# EAGLE design zik-pcb-gpu-f407 (EAGLE 6.5.0)
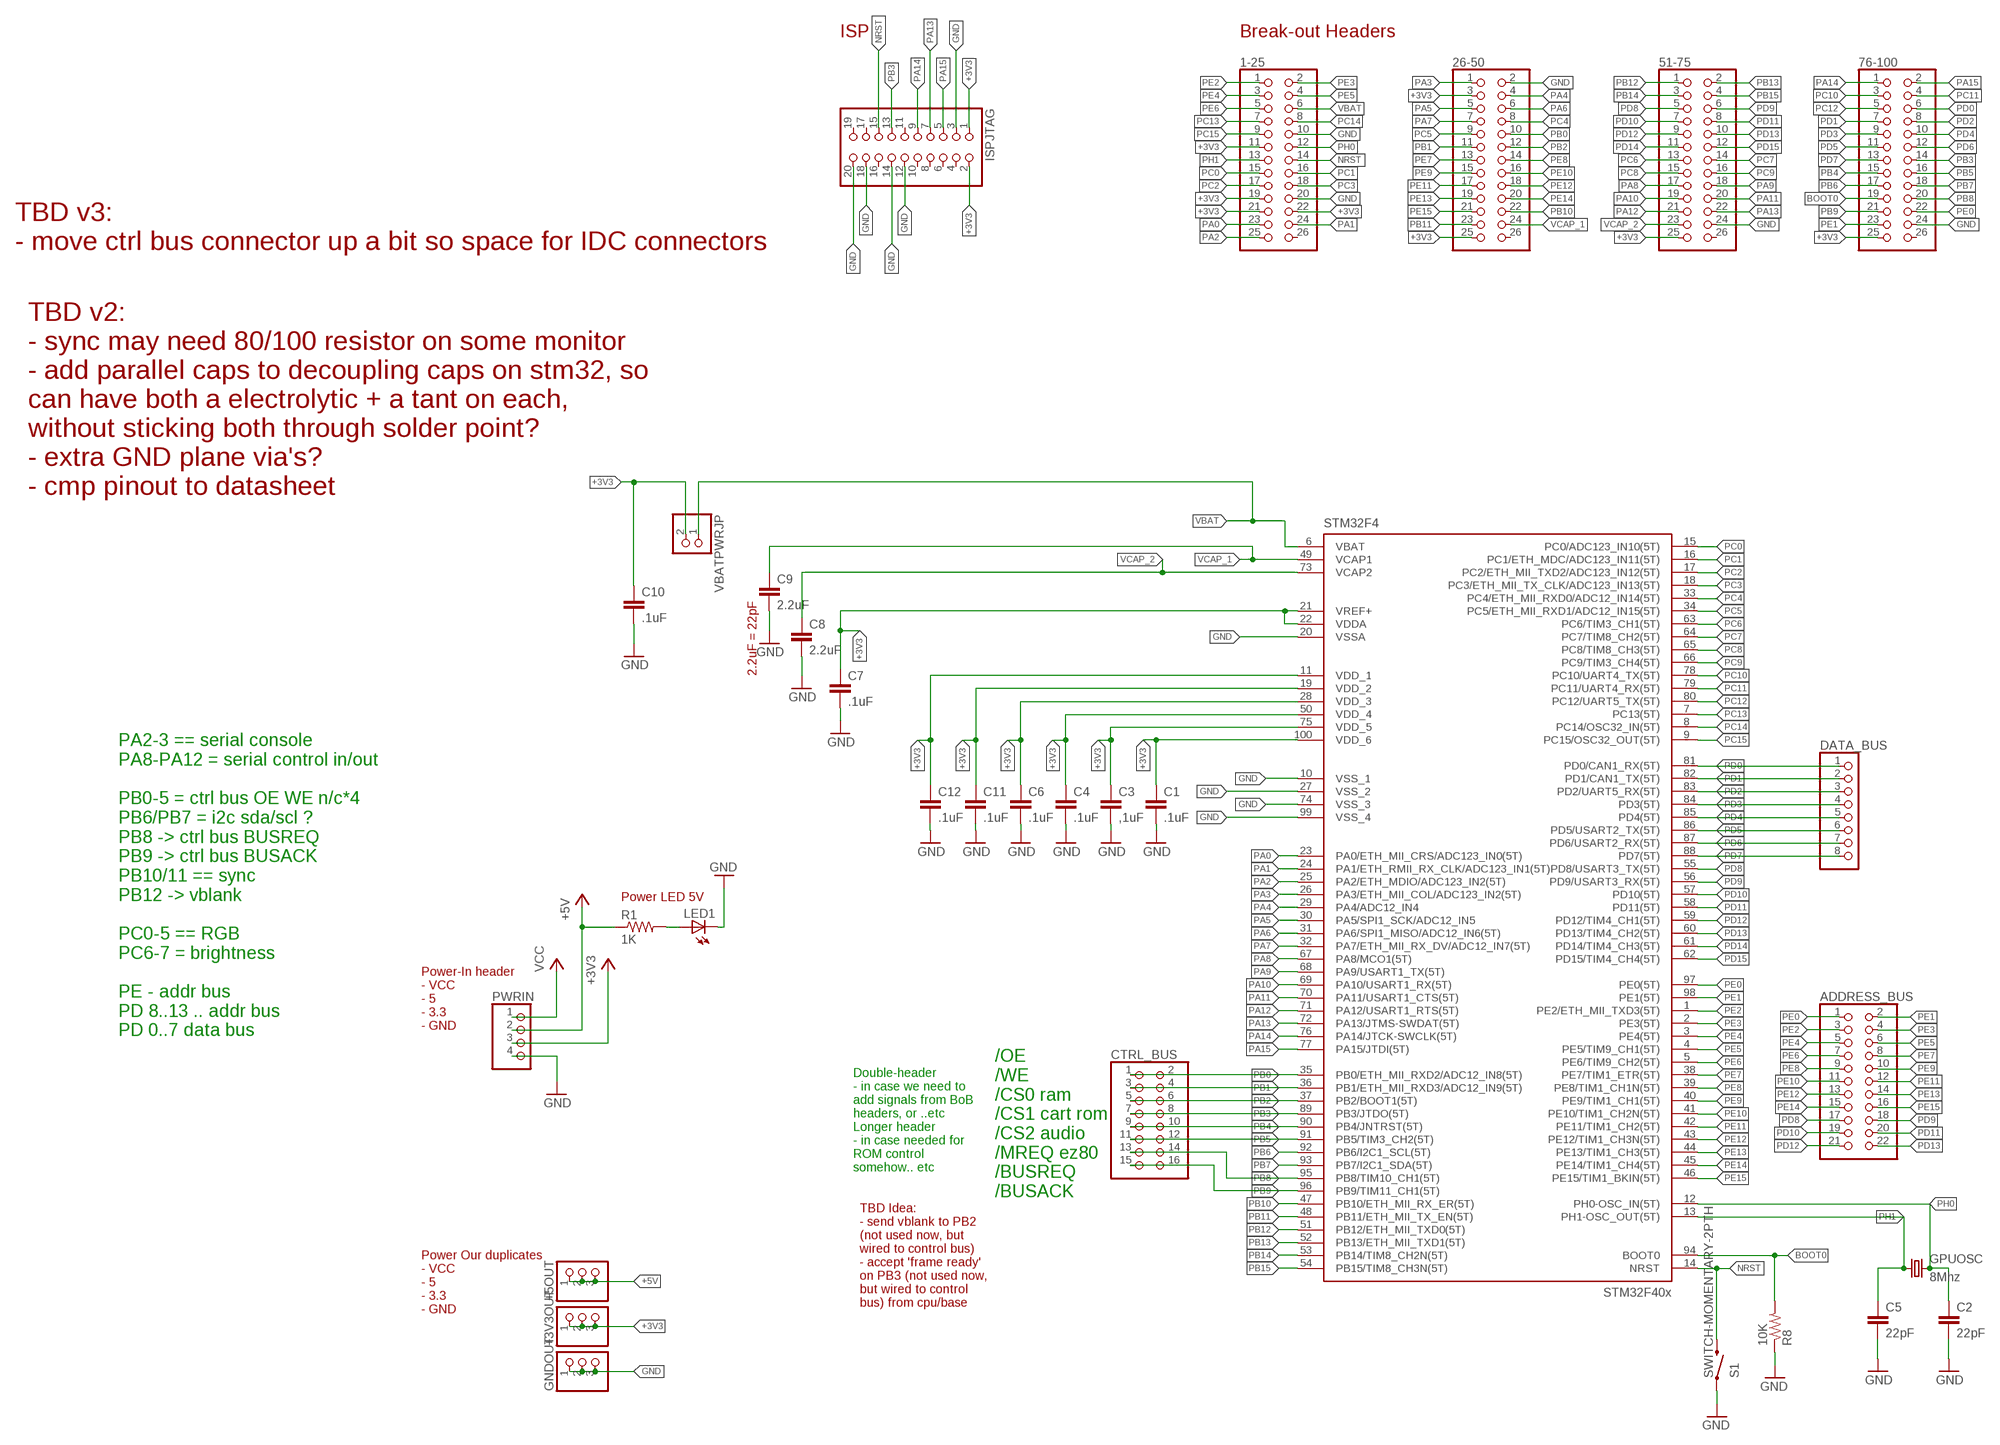
[diagram p0: schematic, sheet 1, part 1 of 2]
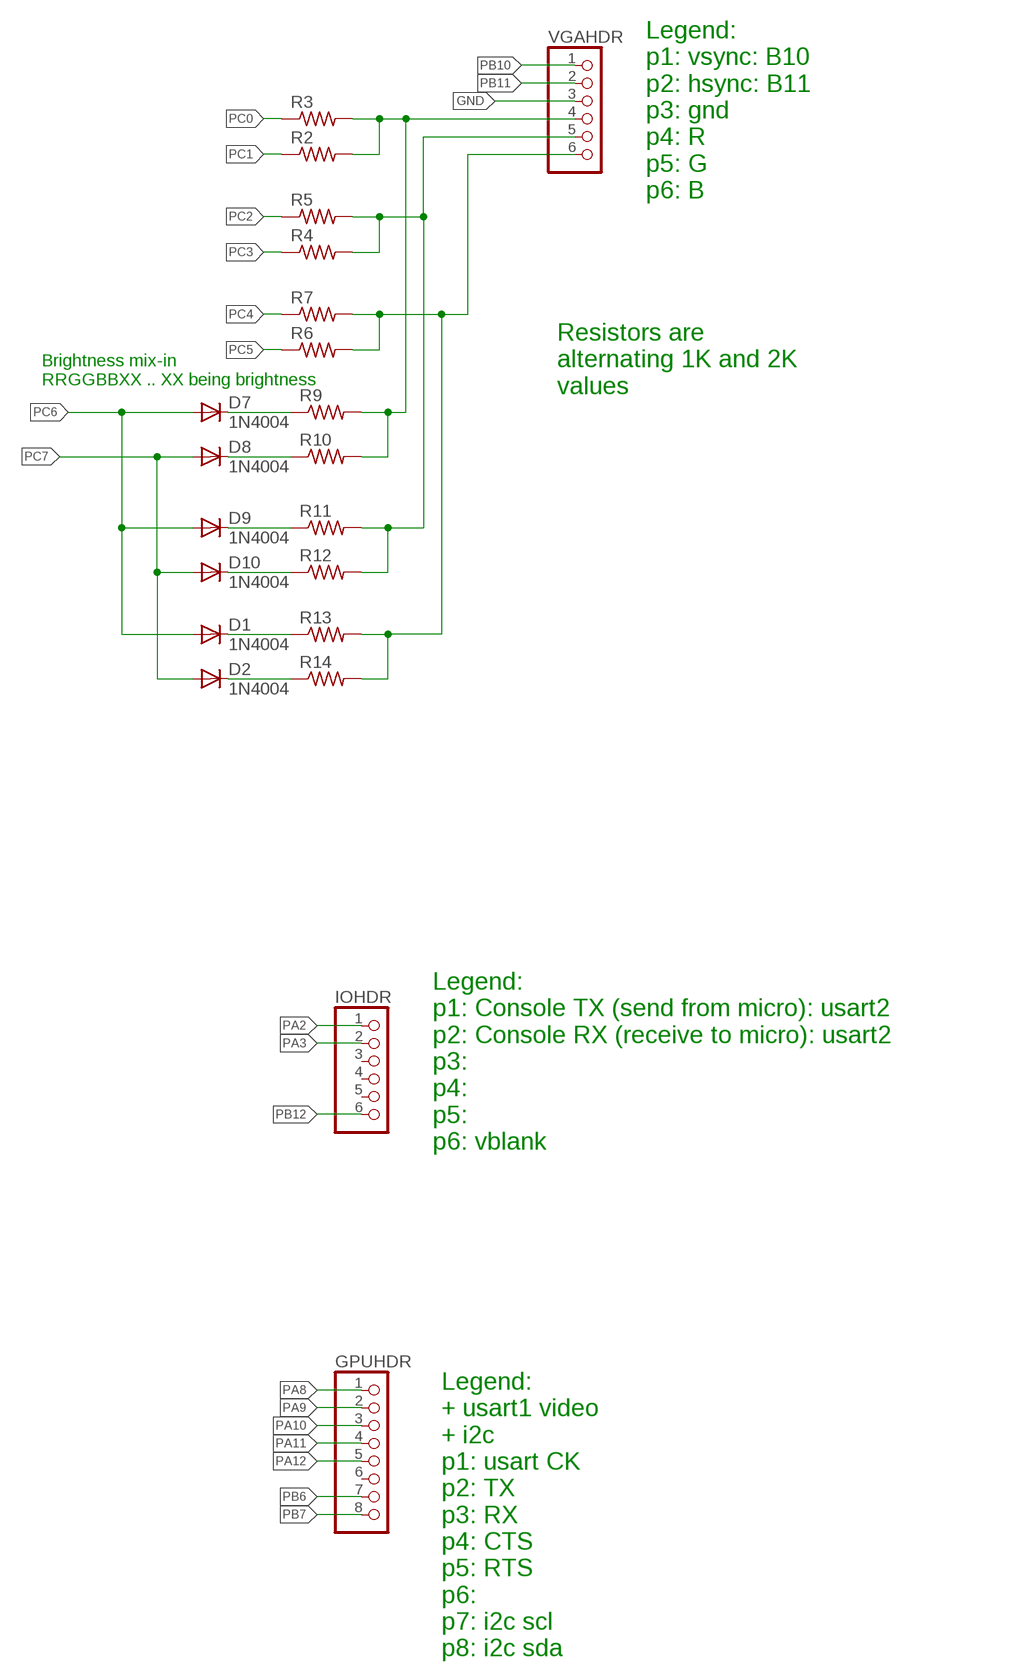
[diagram p1: schematic, sheet 1, part 2 of 2]

## Parts
1-25  PINHD-2X13  [2X13]
26-50  PINHD-2X13  [2X13]
51-75  PINHD-2X13  [2X13]
76-100  PINHD-2X13  [2X13]
+3V3OUT  PINHD-1X3  [1X03]
+5OUT  PINHD-1X3  [1X03]
ADDRESS_BUS  PINHD-2X11  [2X11]
C1  .1uF  C-EU025-025X050  [C025-025X050]
C2  22pF  C-EU025-025X050  [C025-025X050]
C3  ,1uF  C-EU025-025X050  [C025-025X050]
C4  .1uF  C-EU025-025X050  [C025-025X050]
C5  22pF  C-EU025-025X050  [C025-025X050]
C6  .1uF  C-EU025-025X050  [C025-025X050]
C7  .1uF  C-EU025-025X050  [C025-025X050]
C8  2.2uF  C-EU025-025X050  [C025-025X050]
C9  2.2uF  C-EU025-025X050  [C025-025X050]
C10  .1uF  C-EU025-025X050  [C025-025X050]
C11  .1uF  C-EU025-025X050  [C025-025X050]
C12  .1uF  C-EU025-025X050  [C025-025X050]
CTRL_BUS  PINHD-2X8  [2X08]
D1  1N4004  [DO41-10]
D2  1N4004  [DO41-10]
D7  1N4004  [DO41-10]
D8  1N4004  [DO41-10]
D9  1N4004  [DO41-10]
D10  1N4004  [DO41-10]
DATA_BUS  PINHD-1X8  [1X08]
GNDOUT  PINHD-1X3  [1X03]
GPUHDR  PINHD-1X8  [1X08]
GPUOSC  8Mhz  CRYSTALHC49US  [HC49US]
IOHDR  PINHD-1X6  [1X06]
ISPJTAG  PINHD-2X10  [2X10]
LED1  LED5MM  [LED5MM]
PWRIN  PINHD-1X4  [1X04]
R1  1K  R-US_0207/10  [0207/10]
R2  R-US_0207/10  [0207/10]
R3  R-US_0207/10  [0207/10]
R4  R-US_0207/10  [0207/10]
R5  R-US_0207/10  [0207/10]
R6  R-US_0207/10  [0207/10]
R7  R-US_0207/10  [0207/10]
R8  10K  R-US_0207/10  [0207/10]
R9  R-US_0207/10  [0207/10]
R10  R-US_0207/10  [0207/10]
R11  R-US_0207/10  [0207/10]
R12  R-US_0207/10  [0207/10]
R13  R-US_0207/10  [0207/10]
R14  R-US_0207/10  [0207/10]
S1  SWITCH-MOMENTARY-2PTH  [TACTILE-PTH]
STM32F4  STM32F407V  [TQFP100]
VBATPWRJP  PINHD-1X2  [1X02]
VGAHDR  PINHD-1X6  [1X06]

## Nets
+3V3: 1-25.11 1-25.19 1-25.21 1-25.22 26-50.3 26-50.25 51-75.25 76-100.25 +3V3OUT.1 +3V3OUT.2 +3V3OUT.3 C1.1 C3.1 C4.1 C6.1 C7.1 C10.1 C11.1 C12.1 ISPJTAG.1 ISPJTAG.2 PWRIN.3 STM32F4.11(VDD_1) STM32F4.19(VDD_2) STM32F4.21(VREF+) STM32F4.22(VDDA) STM32F4.28(VDD_3) STM32F4.50(VDD_4) STM32F4.75(VDD_5) STM32F4.100(VDD_6) VBATPWRJP.2
+5V: +5OUT.1 +5OUT.2 +5OUT.3 PWRIN.2 R1.1
BOOT0: 76-100.19 R8.2 STM32F4.94(BOOT0)
GND: 1-25.10 1-25.20 26-50.2 51-75.24 76-100.24 C1.2 C2.2 C3.2 C4.2 C5.2 C6.2 C7.2 C8.2 C9.2 C10.2 C11.2 C12.2 GNDOUT.1 GNDOUT.2 GNDOUT.3 ISPJTAG.3 ISPJTAG.12 ISPJTAG.14 ISPJTAG.18 ISPJTAG.20 LED1.K(C) PWRIN.4 R8.1 S1.1 STM32F4.10(VSS_1) STM32F4.20(VSSA) STM32F4.27(VSS_2) STM32F4.74(VSS_3) STM32F4.99(VSS_4) VGAHDR.3
N$3: LED1.A R1.2
N$4: D7.C R9.1
N$5: R4.2 R5.2 R11.2 R12.2 VGAHDR.5
N$7: D8.C R10.1
N$8: R6.2 R7.2 R13.2 R14.2 VGAHDR.6
N$9: R2.2 R3.2 R9.2 R10.2 VGAHDR.4
N$12: D9.C R11.1
N$14: D10.C R12.1
N$17: D1.C R13.1
N$19: D2.C R14.1
NRST: 1-25.14 ISPJTAG.15 S1.3 STM32F4.14(NRST)
PA0: 1-25.23 STM32F4.23(PA0/ETH_MII_CRS/ADC123_IN0(5T))
PA1: 1-25.24 STM32F4.24(PA1/ETH_RMII_RX_CLK/ADC123_IN1(5T))
PA2: 1-25.25 IOHDR.1 STM32F4.25(PA2/ETH_MDIO/ADC123_IN2(5T))
PA3: 26-50.1 IOHDR.2 STM32F4.26(PA3/ETH_MII_COL/ADC123_IN2(5T))
PA4: 26-50.4 STM32F4.29(PA4/ADC12_IN4)
PA5: 26-50.5 STM32F4.30(PA5/SPI1_SCK/ADC12_IN5)
PA6: 26-50.6 STM32F4.31(PA6/SPI1_MISO/ADC12_IN6(5T))
PA7: 26-50.7 STM32F4.32(PA7/ETH_MII_RX_DV/ADC12_IN7(5T))
PA8: 51-75.17 GPUHDR.1 STM32F4.67(PA8/MCO1(5T))
PA9: 51-75.18 GPUHDR.2 STM32F4.68(PA9/USART1_TX(5T))
PA10: 51-75.19 GPUHDR.3 STM32F4.69(PA10/USART1_RX(5T))
PA11: 51-75.20 GPUHDR.4 STM32F4.70(PA11/USART1_CTS(5T))
PA12: 51-75.21 GPUHDR.5 STM32F4.71(PA12/USART1_RTS(5T))
PA13: 51-75.22 ISPJTAG.7 STM32F4.72(PA13/JTMS-SWDAT(5T))
PA14: 76-100.1 ISPJTAG.9 STM32F4.76(PA14/JTCK-SWCLK(5T))
PA15: 76-100.2 ISPJTAG.5 STM32F4.77(PA15/JTDI(5T))
PB0: 26-50.10 CTRL_BUS.1 CTRL_BUS.2 STM32F4.35(PB0/ETH_MII_RXD2/ADC12_IN8(5T))
PB1: 26-50.11 CTRL_BUS.3 CTRL_BUS.4 STM32F4.36(PB1/ETH_MII_RXD3/ADC12_IN9(5T))
PB2: 26-50.12 CTRL_BUS.5 CTRL_BUS.6 STM32F4.37(PB2/BOOT1(5T))
PB3: 76-100.14 CTRL_BUS.7 CTRL_BUS.8 ISPJTAG.13 STM32F4.89(PB3/JTDO(5T))
PB4: 76-100.15 CTRL_BUS.9 CTRL_BUS.10 STM32F4.90(PB4/JNTRST(5T))
PB5: 76-100.16 CTRL_BUS.11 CTRL_BUS.12 STM32F4.91(PB5/TIM3_CH2(5T))
PB6: 76-100.17 GPUHDR.7 STM32F4.92(PB6/I2C1_SCL(5T))
PB7: 76-100.18 GPUHDR.8 STM32F4.93(PB7/I2C1_SDA(5T))
PB8: 76-100.20 CTRL_BUS.13 CTRL_BUS.14 STM32F4.95(PB8/TIM10_CH1(5T))
PB9: 76-100.21 CTRL_BUS.15 CTRL_BUS.16 STM32F4.96(PB9/TIM11_CH1(5T))
PB10: 26-50.22 STM32F4.47(PB10/ETH_MII_RX_ER(5T)) VGAHDR.1
PB11: 26-50.23 STM32F4.48(PB11/ETH_MII_TX_EN(5T)) VGAHDR.2
PB12: 51-75.1 IOHDR.6 STM32F4.51(PB12/ETH_MII_TXD0(5T))
PB13: 51-75.2 STM32F4.52(PB13/ETH_MII_TXD1(5T))
PB14: 51-75.3 STM32F4.53(PB14/TIM8_CH2N(5T))
PB15: 51-75.4 STM32F4.54(PB15/TIM8_CH3N(5T))
PC0: 1-25.15 R3.1 STM32F4.15(PC0/ADC123_IN10(5T))
PC1: 1-25.16 R2.1 STM32F4.16(PC1/ETH_MDC/ADC123_IN11(5T))
PC2: 1-25.17 R5.1 STM32F4.17(PC2/ETH_MII_TXD2/ADC123_IN12(5T))
PC3: 1-25.18 R4.1 STM32F4.18(PC3/ETH_MII_TX_CLK/ADC123_IN13(5T))
PC4: 26-50.8 R7.1 STM32F4.33(PC4/ETH_MII_RXD0/ADC12_IN14(5T))
PC5: 26-50.9 R6.1 STM32F4.34(PC5/ETH_MII_RXD1/ADC12_IN15(5T))
PC6: 51-75.13 D1.A D7.A D9.A STM32F4.63(PC6/TIM3_CH1(5T))
PC7: 51-75.14 D2.A D8.A D10.A STM32F4.64(PC7/TIM8_CH2(5T))
PC8: 51-75.15 STM32F4.65(PC8/TIM8_CH3(5T))
PC9: 51-75.16 STM32F4.66(PC9/TIM3_CH4(5T))
PC10: 76-100.3 STM32F4.78(PC10/UART4_TX(5T))
PC11: 76-100.4 STM32F4.79(PC11/UART4_RX(5T))
PC12: 76-100.5 STM32F4.80(PC12/UART5_TX(5T))
PC13: 1-25.7 STM32F4.7(PC13(5T))
PC14: 1-25.8 STM32F4.8(PC14/OSC32_IN(5T))
PC15: 1-25.9 STM32F4.9(PC15/OSC32_OUT(5T))
PD0: 76-100.6 DATA_BUS.1 STM32F4.81(PD0/CAN1_RX(5T))
PD1: 76-100.7 DATA_BUS.2 STM32F4.82(PD1/CAN1_TX(5T))
PD2: 76-100.8 DATA_BUS.3 STM32F4.83(PD2/UART5_RX(5T))
PD3: 76-100.9 DATA_BUS.4 STM32F4.84(PD3(5T))
PD4: 76-100.10 DATA_BUS.5 STM32F4.85(PD4(5T))
PD5: 76-100.11 DATA_BUS.6 STM32F4.86(PD5/USART2_TX(5T))
PD6: 76-100.12 DATA_BUS.7 STM32F4.87(PD6/USART2_RX(5T))
PD7: 76-100.13 DATA_BUS.8 STM32F4.88(PD7(5T))
PD8: 51-75.5 ADDRESS_BUS.17 STM32F4.55(PD8/USART3_TX(5T))
PD9: 51-75.6 ADDRESS_BUS.18 STM32F4.56(PD9/USART3_RX(5T))
PD10: 51-75.7 ADDRESS_BUS.19 STM32F4.57(PD10(5T))
PD11: 51-75.8 ADDRESS_BUS.20 STM32F4.58(PD11(5T))
PD12: 51-75.9 ADDRESS_BUS.21 STM32F4.59(PD12/TIM4_CH1(5T))
PD13: 51-75.10 ADDRESS_BUS.22 STM32F4.60(PD13/TIM4_CH2(5T))
PD14: 51-75.11 STM32F4.61(PD14/TIM4_CH3(5T))
PD15: 51-75.12 STM32F4.62(PD15/TIM4_CH4(5T))
PE0: 76-100.22 ADDRESS_BUS.1 STM32F4.97(PE0(5T))
PE1: 76-100.23 ADDRESS_BUS.2 STM32F4.98(PE1(5T))
PE2: 1-25.1 ADDRESS_BUS.3 STM32F4.1(PE2/ETH_MII_TXD3(5T))
PE3: 1-25.2 ADDRESS_BUS.4 STM32F4.2(PE3(5T))
PE4: 1-25.3 ADDRESS_BUS.5 STM32F4.3(PE4(5T))
PE5: 1-25.4 ADDRESS_BUS.6 STM32F4.4(PE5/TIM9_CH1(5T))
PE6: 1-25.5 ADDRESS_BUS.7 STM32F4.5(PE6/TIM9_CH2(5T))
PE7: 26-50.13 ADDRESS_BUS.8 STM32F4.38(PE7/TIM1_ETR(5T))
PE8: 26-50.14 ADDRESS_BUS.9 STM32F4.39(PE8/TIM1_CH1N(5T))
PE9: 26-50.15 ADDRESS_BUS.10 STM32F4.40(PE9/TIM1_CH1(5T))
PE10: 26-50.16 ADDRESS_BUS.11 STM32F4.41(PE10/TIM1_CH2N(5T))
PE11: 26-50.17 ADDRESS_BUS.12 STM32F4.42(PE11/TIM1_CH2(5T))
PE12: 26-50.18 ADDRESS_BUS.13 STM32F4.43(PE12/TIM1_CH3N(5T))
PE13: 26-50.19 ADDRESS_BUS.14 STM32F4.44(PE13/TIM1_CH3(5T))
PE14: 26-50.20 ADDRESS_BUS.15 STM32F4.45(PE14/TIM1_CH4(5T))
PE15: 26-50.21 ADDRESS_BUS.16 STM32F4.46(PE15/TIM1_BKIN(5T))
PH0: 1-25.12 C2.1 GPUOSC.2 STM32F4.12(PH0-OSC_IN(5T))
PH1: 1-25.13 C5.1 GPUOSC.1 STM32F4.13(PH1-OSC_OUT(5T))
VBAT: 1-25.6 STM32F4.6(VBAT) VBATPWRJP.1
VCAP_1: 26-50.24 C9.1 STM32F4.49(VCAP1)
VCAP_2: 51-75.23 C8.1 STM32F4.73(VCAP2)
VCC: PWRIN.1
Unconnected: 1-25.26 26-50.26 51-75.26 76-100.26 GPUHDR.6 IOHDR.3 IOHDR.4 IOHDR.5 ISPJTAG.4 ISPJTAG.6 ISPJTAG.8 ISPJTAG.10 ISPJTAG.11 ISPJTAG.16 ISPJTAG.17 ISPJTAG.19

## Notes on the sheet
- ISP | Break-out Headers
- Legend:
  p1: vsync: B10
  p2: hsync: B11
  p3: gnd
  p4: R
  p5: G
  p6: B
- TBD v3:
  - move ctrl bus connector up a bit so space for IDC connectors
- Brightness mix-in
  RRGGBBXX .. XX being brightness
- Resistors are
  alternating 1K and 2K
  values
- TBD v2:
  - sync may need 80/100 resistor on some monitor
  - add parallel caps to decoupling caps on stm32, so
  can have both a electrolytic + a tant on each,
  without sticking both through solder point?
  - extra GND plane via's?
  - cmp pinout to datasheet
- 2.2uF = 22pF
- Legend:
  p1: Console TX (send from micro): usart2
  p2: Console RX (receive to micro): usart2
  p3: 
  p4: 
  p5: 
  p6: vblank
- Power LED 5V
- Power-In header
  - VCC
  - 5
  - 3.3
  - GND
- PA2-3 == serial console
  PA8-PA12 = serial control in/out
  
  PB0-5 = ctrl bus OE WE n/c*4
  PB6/PB7 = i2c sda/scl ?
  PB8 -> ctrl bus BUSREQ
  PB9 -> ctrl bus BUSACK
  PB10/11 == sync
  PB12 -> vblank
  
  PC0-5 == RGB
  PC6-7 = brightness
  
  PE - addr bus
  PD 8..13 .. addr bus
  PD 0..7 data bus
- Double-header
  - in case we need to
  add signals from BoB
  headers, or ..etc
  Longer header
  - in case needed for
  ROM control
  somehow.. etc
- /OE
  /WE
  /CS0 ram
  /CS1 cart rom
  /CS2 audio
  /MREQ ez80
  /BUSREQ
  /BUSACK
- Legend:
  + usart1 video
  + i2c
  p1: usart CK
  p2: TX
  p3: RX
  p4: CTS
  p5: RTS
  p6:
  p7: i2c scl
  p8: i2c sda
- TBD Idea:
  - send vblank to PB2
  (not used now, but
  wired to control bus)
  - accept 'frame ready'
  on PB3 (not used now,
  but wired to control
  bus) from cpu/base
- Power Our duplicates
  - VCC
  - 5
  - 3.3
  - GND

## Library data of the parts
1-25 26-50 51-75 76-100 = pinhead:PINHD-2X13: PIN HEADER
+3V3OUT +5OUT GNDOUT = pinhead:PINHD-1X3: PIN HEADER
ADDRESS_BUS = pinhead:PINHD-2X11: PIN HEADER
C1-C12 = rcl:C-EU: CAPACITOR, European symbol
CTRL_BUS = pinhead:PINHD-2X8: PIN HEADER
D1 D2 D7-D10 = diode:1N4004: DIODE general purpose rectifier, 1 A
DATA_BUS GPUHDR = pinhead:PINHD-1X8: PIN HEADER
GPUOSC = SparkFun-FreqCtrl:CRYSTAL: Various standard crystals. Proven footprints. Spark Fun Electronics SKU : COM-00534
IOHDR VGAHDR = pinhead:PINHD-1X6: PIN HEADER
ISPJTAG = pinhead:PINHD-2X10: PIN HEADER
LED1 = SparkFun-LED:LED: LEDs Standard schematic elements and footprints for 5mm, 3mm, 1206, and 0603 sized LEDs. 5mm - Spark Fun Electronics SKU : COM-00529 (and others)
PWRIN = pinhead:PINHD-1X4: PIN HEADER
R1-R14 = rcl:R-US_: RESISTOR, American symbol
S1 = SparkFun-Electromechanical:SWITCH-MOMENTARY-2: Various NO switches- pushbuttons, reed, etc
STM32F4 = stm32f4:STM32F407V: STM32F407 100 pin LQFP reviewed: YES tested: YES
VBATPWRJP = pinhead:PINHD-1X2: PIN HEADER

## Board
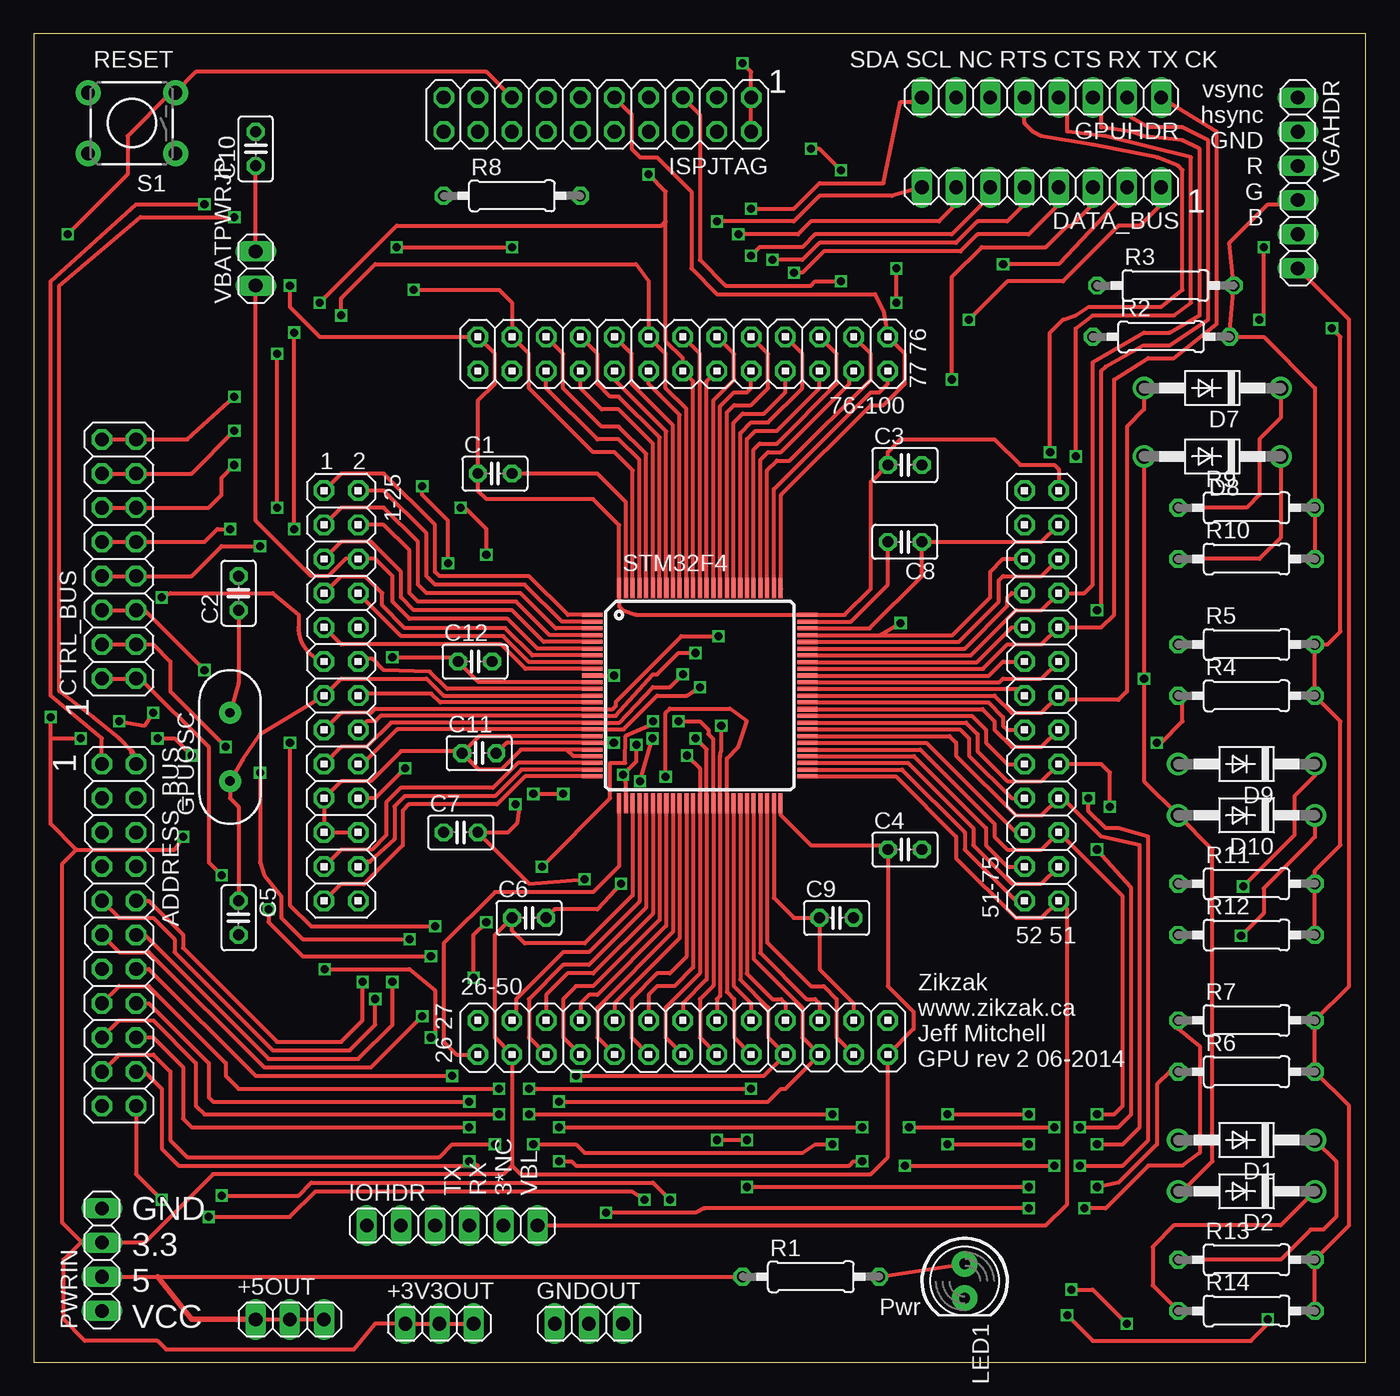
[diagram p2: board, top side]
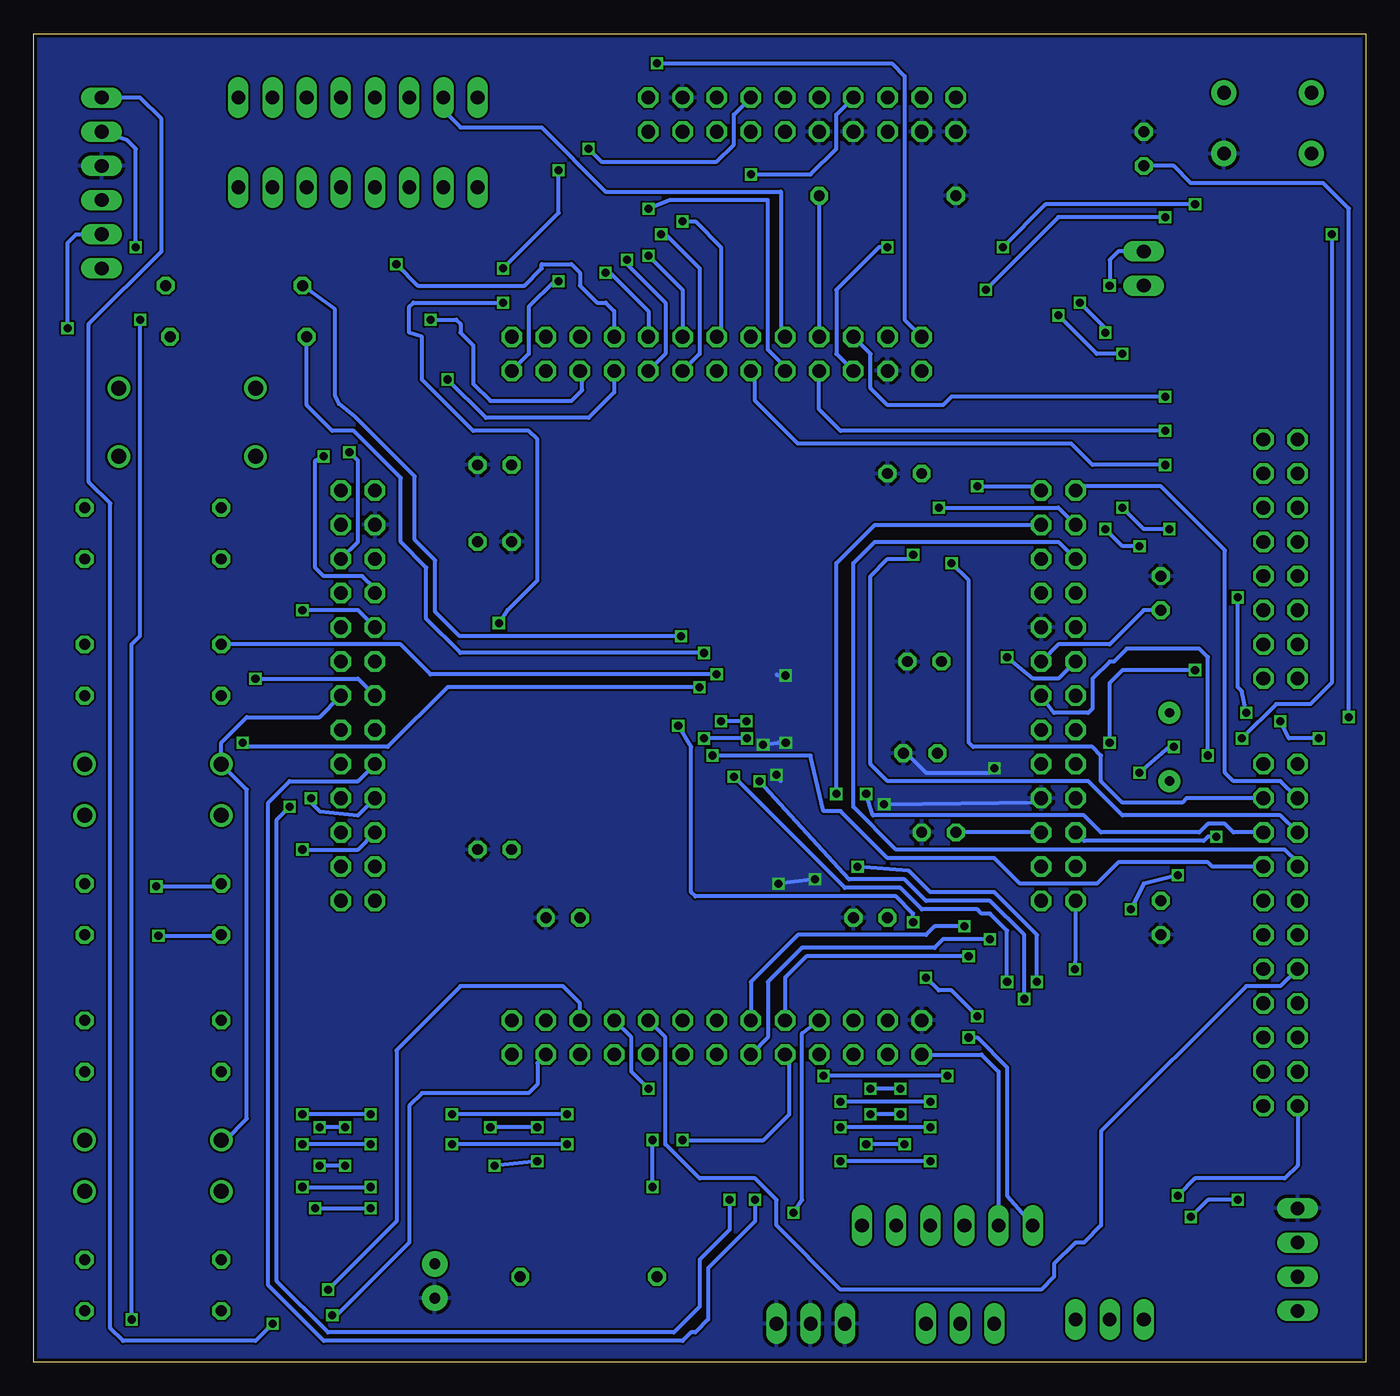
[diagram p3: board, bottom side, seen from below]

Size 99.04 x 98.73 mm. Coordinates in mm from the lower left corner, seen from the top.
Outline: 0,0 99.04,0 99.04,98.73 0,98.73 0,0
Copper layers (1*16): Top 0.035mm / dielectric 1.5mm / Bottom 0.035mm
Design rules "Elecrow_2-layer_eagle_rule": minimum track width 6mil, minimum drill 12mil, track to track 6mil, track to pad 6mil, pad to pad 6mil, via to via 6mil, smd to smd 0mil, copper to edge 10mil, drill to drill 10mil, minimum pad ring 10mil, minimum via ring 6mil, stop-mask expansion 2mil, vias tented up to drill 100mil, thermal gap 10mil

### Footprints (pad centres in the part's own frame; a part is rotated, then mirrored left to right if it is on the bottom)
2X13 = drill 1.016 octagon: 1 -15.24,-1.27; 2 -15.24,1.27; 3 -12.7,-1.27; 4 -12.7,1.27; 5 -10.16,-1.27; 6 -10.16,1.27; 7 -7.62,-1.27; 8 -7.62,1.27; 9 -5.08,-1.27; 10 -5.08,1.27; 11 -2.54,-1.27; 12 -2.54,1.27; 13 0,-1.27; 14 0,1.27; 15 2.54,-1.27; 16 2.54,1.27; 17 5.08,-1.27; 18 5.08,1.27; 19 7.62,-1.27; 20 7.62,1.27; 21 10.16,-1.27; 22 10.16,1.27; 23 12.7,-1.27; 24 12.7,1.27; 25 15.24,-1.27; 26 15.24,1.27
1X03 = drill 1.016 long: 1 -2.54,0; 2 0,0; 3 2.54,0
2X11 = drill 1.016 octagon: 1 -12.7,-1.27; 2 -12.7,1.27; 3 -10.16,-1.27; 4 -10.16,1.27; 5 -7.62,-1.27; 6 -7.62,1.27; 7 -5.08,-1.27; 8 -5.08,1.27; 9 -2.54,-1.27; 10 -2.54,1.27; 11 0,-1.27; 12 0,1.27; 13 2.54,-1.27; 14 2.54,1.27; 15 5.08,-1.27; 16 5.08,1.27; 17 7.62,-1.27; 18 7.62,1.27; 19 10.16,-1.27; 20 10.16,1.27; 21 12.7,-1.27; 22 12.7,1.27
C025-025X050 = drill 0.813 octagon: 1 -1.27,0; 2 1.27,0
2X08 = drill 1.016 octagon: 1 -8.89,-1.27; 2 -8.89,1.27; 3 -6.35,-1.27; 4 -6.35,1.27; 5 -3.81,-1.27; 6 -3.81,1.27; 7 -1.27,-1.27; 8 -1.27,1.27; 9 1.27,-1.27; 10 1.27,1.27; 11 3.81,-1.27; 12 3.81,1.27; 13 6.35,-1.27; 14 6.35,1.27; 15 8.89,-1.27; 16 8.89,1.27
DO41-10 = drill 1.118: A 5.08,0; C -5.08,0
1X08 = drill 1.016 long: 1 -8.89,0; 2 -6.35,0; 3 -3.81,0; 4 -1.27,0; 5 1.27,0; 6 3.81,0; 7 6.35,0; 8 8.89,0
HC49US = drill 0.7 pad 1.651: 1 -2.54,0; 2 2.54,0
1X06 = drill 1.016 long: 1 -6.35,0; 2 -3.81,0; 3 -1.27,0; 4 1.27,0; 5 3.81,0; 6 6.35,0
2X10 = drill 1.016 octagon: 1 -11.43,-1.27; 2 -11.43,1.27; 3 -8.89,-1.27; 4 -8.89,1.27; 5 -6.35,-1.27; 6 -6.35,1.27; 7 -3.81,-1.27; 8 -3.81,1.27; 9 -1.27,-1.27; 10 -1.27,1.27; 11 1.27,-1.27; 12 1.27,1.27; 13 3.81,-1.27; 14 3.81,1.27; 15 6.35,-1.27; 16 6.35,1.27; 17 8.89,-1.27; 18 8.89,1.27; 19 11.43,-1.27; 20 11.43,1.27
LED5MM = drill 0.813 pad 1.88: A -1.27,0; K 1.27,0
1X04 = drill 1.016 long: 1 -3.81,0; 2 -1.27,0; 3 1.27,0; 4 3.81,0
0207/10 = drill 0.813 octagon: 1 -5.08,0; 2 5.08,0
TACTILE-PTH = drill 1.016 pad 1.88: 1 -3.251,2.261; 2 3.251,2.261; 3 -3.251,-2.261; 4 3.251,-2.261
TQFP100 = smd 1.5 x 0.3: 1 -8,6; 2 -8,5.5; 3 -8,5; 4 -8,4.5; 5 -8,4; 6 -8,3.5; 7 -8,3; 8 -8,2.5; 9 -8,2; 10 -8,1.5; 11 -8,1; 12 -8,0.5; 13 -8,0; 14 -8,-0.5; 15 -8,-1; 16 -8,-1.5; 17 -8,-2; 18 -8,-2.5; 19 -8,-3; 20 -8,-3.5; 21 -8,-4; 22 -8,-4.5; 23 -8,-5; 24 -8,-5.5; 25 -8,-6; 51 8,-6; 52 8,-5.5; 53 8,-5; 54 8,-4.5; 55 8,-4; 56 8,-3.5; 57 8,-3; 58 8,-2.5; 59 8,-2; 60 8,-1.5; 62 8,-0.5; 63 8,0; 64 8,0.5; 65 8,1; 66 8,1.5; 67 8,2; 68 8,2.5; 69 8,3; 70 8,3.5; 72 8,4.5; 73 8,5; 74 8,5.5; 75 8,6 | smd 0.3 x 1.5: 26 -6,-8; 27 -5.5,-8; 28 -5,-8; 29 -4.5,-8; 30 -4,-8; 31 -3.5,-8; 32 -3,-8; 33 -2.5,-8; 34 -2,-8; 35 -1.5,-8; 36 -1,-8; 37 -0.5,-8; 38 0,-8; 39 0.5,-8; 40 1,-8; 41 1.5,-8; 42 2,-8; 43 2.5,-8; 44 3,-8; 45 3.5,-8; 46 4,-8; 47 4.5,-8; 48 5,-8; 49 5.5,-8; 50 6,-8; 76 6,8; 77 5.5,8; 78 5,8; 79 4.5,8; 80 4,8; 81 3.5,8; 82 3,8; 83 2.5,8; 84 2,8; 85 1.5,8; 86 1,8; 87 0.5,8; 88 0,8; 89 -0.5,8; 90 -1,8; 91 -1.5,8; 92 -2,8; 93 -2.5,8; 94 -3,8; 95 -3.5,8; 96 -4,8; 97 -4.5,8; 98 -5,8; 99 -5.5,8; 100 -6,8 | smd 1.5 x 0.35: 61 8,-1; 71 8,4
1X02 = drill 1.016 long: 1 -1.27,0; 2 1.27,0

### Placement (x,y rotation side)
1-25  22.86,49.53 270 top
26-50  48.26,24.13 0 top
51-75  74.93,49.53 90 top
76-100  48.26,74.93 180 top
+3V3OUT  30.16,2.86 0 top
+5OUT  19.05,3.17 0 top
ADDRESS_BUS  6.35,31.75 270 top
C1  34.29,66.04 0 top
C2  15.24,57.15 90 top
C3  64.77,66.67 0 top
C4  64.77,38.1 0 top
C5  15.24,33.02 270 top
C6  36.83,33.02 0 top
C7  31.75,39.37 0 top
C8  64.77,60.96 180 top
C9  59.69,33.02 0 top
C10  16.51,90.17 90 top
C11  33.12,45.26 0 top
C12  32.82,52.07 0 top
CTRL_BUS  6.35,59.69 90 top
D1  90.17,16.51 180 top
D2  90.17,12.7 180 top
D7  87.63,72.39 180 top
D8  87.63,67.31 180 top
D9  90.17,44.45 180 top
D10  90.17,40.64 180 top
DATA_BUS  74.93,87.31 180 top
GNDOUT  41.27,2.86 0 top
GPUHDR  74.93,93.98 180 top
GPUOSC  14.61,45.72 90 top
IOHDR  31.11,10.16 0 top
ISPJTAG  41.91,92.71 180 top
LED1  69.22,6.03 270 top
PWRIN  5.08,7.62 90 top
R1  57.78,6.35 0 top
R2  83.82,76.2 0 top
R3  84.14,80.01 0 top
R4  90.17,49.53 0 top
R5  90.17,53.34 0 top
R6  90.17,21.59 0 top
R7  90.17,25.4 0 top
R8  35.56,86.68 0 top
R9  90.17,63.5 0 top
R10  90.17,59.69 0 top
R11  90.17,35.56 0 top
R12  90.17,31.75 0 top
R13  90.17,7.62 0 top
R14  90.17,3.81 0 top
S1  7.3,92.08 180 top
STM32F4  49.53,49.53 0 top
VBATPWRJP  16.51,81.28 90 top
VGAHDR  93.98,87.63 270 top

### Tracks (layer width: path | path; a pad name or v marks a point on that pad's centre or on a via)
+3V3  (via drill 0.6)
  Top 0.305: STM32F4.11 33.09,50.53 C12.1 31.23,52.39 v26.67,52.39 | STM32F4.19 33.12,46.53 C11.1 33.07,44.04 | STM32F4.21 39.62,45.53 | 39.62,45.53 36.23,45.53 34.75,44.04 33.07,44.04 | STM32F4.22 40.12,45.03 39.62,45.53 | STM32F4.50 55.53,40.67 57.78,38.42 63.18,38.42 C4.1 63.5,27.94 65.41,26.04 65.41,24.77 26-50.25 63.5,15.24 62.23,13.97 36.2,13.97 35.56,14.61 | STM32F4.28 44.53,34.69 40.96,31.11 36.51,31.11 35.56,32.07 C6.1 34.29,31.75 34.29,24.13 26-50.3 35.56,14.61 | VBATPWRJP.2 C10.1 | ISPJTAG.1 ISPJTAG.2 53.34,95.89 v52.7,96.52 | 51-75.25 76.2,66.36 75.88,66.67 73.34,66.67 71.44,68.58 64.45,68.58 63.5,67.63 C3.1 62.23,65.41 62.23,57.47 60.29,55.53 STM32F4.75 57.5,55.56 44.77,55.56 43.81,55.88 43.53,56.16 STM32F4.100 43.53,62.2 41.59,64.14 33.66,64.14 33.02,64.77 C1.1 33.02,71.44 34.29,72.71 34.29,74.93 76-100.25 21.27,76.2 19.05,78.42 v19.05,80.01 | PWRIN.3 3.49,8.89 2.22,7.62 2.22,3.17 3.81,1.59 9.21,1.59 9.84,0.95 23.81,0.95 25.4,2.86 +3V3OUT.1 +3V3OUT.2 +3V3OUT.3 | 35.56,14.61 34.92,13.97 13.34,13.97 8.26,8.89 PWRIN.3 | 1-25.22 1-25.21 1-25.19 22.86,43.18 25.08,43.18 27.3,45.4 31.75,45.4 33.07,44.08 33.07,44.04 | PWRIN.3 3.61,8.89 2.13,10.36 2.13,37.06 3.17,38.1 | 3.17,38.1 10.48,38.1 v11.11,39.05 | 3.17,38.1 1.27,40.01 1.27,46.35 | 1.27,46.35 v1.27,47.94 | 1.27,46.35 v3.49,46.35 | v6.35,47.62 8.26,47.31 v8.89,48.26 | v9.53,56.83 10.16,57.15 17.78,57.15 19.68,55.56 19.68,54.61 arc74 1-25.11
  Bottom 0.305: v52.7,96.52 35.24,96.52 34.29,95.57 34.29,77.47 76-100.25 | VBATPWRJP.2 18.41,82.55 19.05,81.92 v19.05,80.01 | 1-25.11 22.86,50.8 24.77,50.8 v26.67,52.39 | 1-25.22 C7.1 | v11.11,39.05 11.75,39.05 12.06,38.73 20.95,38.73 1-25.21 | v1.27,47.94 1.27,85.72 3.17,87.63 13.02,87.63 14.29,88.9 C10.1 | v3.49,46.35 5.71,46.35 v6.35,47.62 | v8.89,48.26 9.21,49.85 9.53,50.16 v9.53,56.83
+5V
  Top 0.305: PWRIN.2 9.21,6.35 R1.1 | +5OUT.1 +5OUT.2 +5OUT.3
  Top 0.406: +5OUT.1 11.75,3.17 9.21,6.35
BOOT0
  Top 0.305: STM32F4.94 46.53,68.72 43.5,71.75 42.86,71.75 41.91,72.71 41.91,74.93 76-100.19
  Bottom 0.305: R8.2 76-100.19
GND  (via drill 0.6)
  Top 0.305: STM32F4.10 v43.15,51.03 | C11.2 35.16,46.03 STM32F4.20 42.97,46.03 v43.13,46.02 | STM32F4.99 44.03,63.92 41.91,66.04 C1.2 | STM32F4.74 60.74,55.03 63.5,57.78 C8.2 | STM32F4.27 44.03,43.08 v43.81,43.66 44.81,44.65 v44.81,45.87 | v27.62,44.13 25.4,41.91 1-25.20 | v40.96,35.88 36.83,35.56 C7.2 35.26,39.37 35.97,40.08 36.12,41.15 v35.81,41.45 | v43.66,35.56 41.91,33.66 38.73,33.66 C6.2
  Bottom 0.305: v43.15,51.03 43.73,51.03 43.81,51.12 | v43.81,43.66 43.5,43.18 | v43.13,46.02 43.74,46.02 v44.81,45.87 | C11.2 34.15,45.26 32.7,43.81 27.94,43.81 v27.62,44.13 | v40.96,35.88 v43.66,35.56 | v35.81,41.45 24.43,41.6 1-25.20
  pour Bottom: 0,98.74 0,0 99.06,0 99.06,98.74
N$3
  Top 0.305: R1.2 LED1.A
N$4
  Top 0.305: D7.C 92.71,70.17 91.12,68.58 91.12,64.45 90.17,63.5 R9.1
N$5  (via drill 0.6)
  Top 0.305: R12.2 R11.2 95.25,36.51 97.16,38.42 97.16,47.62 R4.2 R5.2 96.2,53.34 97.16,54.29 97.16,76.2 v96.52,76.83
  Bottom 0.305: v96.52,76.83 96.52,83.19 95.89,83.82 VGAHDR.5
N$7
  Top 0.305: D8.C 92.71,61.28 91.12,59.69 R10.1
N$8
  Top 0.305: R14.2 R13.2 97.79,10.16 97.79,19.05 R6.2 R7.2 97.79,27.94 97.79,77.47 VGAHDR.6
N$9
  Top 0.305: R10.2 R9.2 95.25,72.39 91.44,76.2 R2.2 R3.2 88.9,83.19 91.76,86.04 93.66,86.04 VGAHDR.4
N$12  (via drill 0.6)
  Top 0.305: D9.C 95.25,43.59 93.73,42.06 93.73,39.17 v89.92,35.36 | 85.29,35.36 R11.1
  Bottom 0.305: v89.92,35.36 85.29,35.36 R11.1
N$14  (via drill 0.6)
  Top 0.305: D10.C 95.25,39.04 94.64,38.41 91.44,35.2 91.44,33.38 v89.76,31.7 | 85.14,31.7 R12.1
  Bottom 0.305: v89.76,31.7 85.14,31.7 R12.1
N$17
  Top 0.305: D1.C 96.84,14.92 96.84,10.79 95.89,9.84 94.93,9.84 92.71,7.62 90.17,7.62 R13.1
N$19
  Top 0.305: D2.C 92.71,10.16 84.77,10.16 83.19,8.57 83.19,5.71 R14.1
NRST  (via drill 0.6)
  Top 0.305: STM32F4.14 30.22,49.03 29.57,49.68 24.28,49.68 1-25.14 | S1.3 10.55,94.37 | 10.55,94.37 12.06,95.89 33.66,95.89 ISPJTAG.15 | 10.55,94.37 10.48,94.3 10.16,94.3 6.99,91.12 6.99,88.27 v2.54,83.82 | v9.21,46.35 10.48,46.35 v11.75,45.09
  Bottom 0.305: v2.54,83.82 2.54,50.48 4.13,48.9 6.67,48.9 v9.21,46.35 | v11.75,45.09 11.75,52.39 12.38,53.02 17.78,53.02 18.73,52.07 19.05,52.07 20.32,50.8 20.32,48.58 20.64,48.26 23.18,48.26 1-25.14
PA0
  Top 0.305: STM32F4.23 36,44.53 34.14,42.67 27.28,42.67 26.21,41.6 26.21,39.17 25.15,38.1 22.86,38.1 1-25.23
PA1
  Top 0.305: STM32F4.24 36.26,44.03 34.29,42.06 27.58,42.06 26.82,41.3 26.82,38.86 24.99,37.19 24.49,37.19 1-25.24
PA2  (via drill 0.6)
  Top 0.305: STM32F4.25 36.52,43.53 34.44,41.45 27.89,41.45 27.43,41 27.43,38.41 24.54,35.51 22.81,35.51 1-25.25 | v21.64,29.21 27.94,29.21 29.84,27.62 29.84,24.45 v29.53,24.13
  Bottom 0.305: 1-25.25 21.59,30.48 v21.64,29.21 | v29.53,24.13 28.89,24.13 26.67,21.91 26.67,12.38 IOHDR.1
PA3
  Top 0.305: STM32F4.26 43.53,36.86 41.59,34.92 34.29,34.92 30.48,31.11 30.48,23.81 31.43,22.86 26-50.1
  Bottom 0.305: 26-50.1 28.57,22.86 27.3,21.59 IOHDR.2
PA4
  Top 0.305: STM32F4.29 45.03,34.23 41.27,30.48 39.37,30.48 35.88,26.99 35.88,25.72 26-50.4
PA5
  Top 0.305: STM32F4.30 45.53,33.78 41.27,29.53 39.37,29.53 36.83,26.99 36.83,24.13 26-50.5
PA6
  Top 0.305: STM32F4.31 46.03,33.33 41.59,28.89 39.69,28.89 38.1,27.3 26-50.6
PA7
  Top 0.305: STM32F4.32 46.53,32.88 41.59,27.94 40.32,27.94 39.37,26.99 39.37,24.13 26-50.7
PA8
  Top 0.305: STM32F4.67 70.58,51.53 72.39,53.34 74.93,53.34 51-75.17 79.38,54.61 80.33,55.56 80.33,73.03 82.87,74.61 84.77,74.61 87.95,77.15 87.95,91.44 GPUHDR.1
PA9  (via drill 0.6)
  Top 0.305: STM32F4.68 70.13,52.03 72.71,54.61 51-75.18 | v79.06,55.88 79.38,56.2 79.38,73.66 79.69,73.98 82.55,75.56 84.45,75.56 87.31,77.47 87.31,90.81 85.41,91.76 82.87,91.76 81.28,92.71 GPUHDR.2
  Bottom 0.305: 51-75.18 74.93,55.88 v79.06,55.88
PA10
  Top 0.305: STM32F4.69 69.67,52.53 73.03,55.88 74.93,55.88 51-75.19 78.11,57.15 78.74,57.78 78.74,74.3 82.55,76.52 84.45,76.52 86.68,77.79 86.68,90.17 85.41,90.81 82.55,91.12 81.6,91.44 79.38,91.76 79.38,93.34 GPUHDR.3
PA11  (via drill 0.6)
  Top 0.305: STM32F4.70 69.22,53.03 72.39,56.2 72.39,56.83 72.71,57.15 51-75.20 | v77.47,67.31 77.47,76.83 78.74,77.79 84.77,77.79 86.04,78.74 86.04,89.53 79.69,91.12 76.83,91.44 76.83,93.34 GPUHDR.4
  Bottom 0.305: 51-75.20 73.66,57.47 74.61,58.42 77.47,58.42 78.11,59.05 78.11,66.99 v77.47,67.31
PA12  (via drill 0.6)
  Top 0.305: STM32F4.71 68.77,53.53 71.75,56.52 71.75,58.1 72.07,58.42 74.93,58.42 51-75.21 | v75.56,67.63 75.56,76.52 76.52,77.47 77.47,77.79 78.42,78.42 83.82,78.42 85.41,79.69 85.41,88.58 85.09,88.9 83.5,89.53 78.74,90.49 74.93,91.12 74.3,91.44 73.66,92.08 GPUHDR.5
  Bottom 0.305: 51-75.21 74.93,60.96 74.93,66.99 v75.56,67.63
PA13  (via drill 0.6)
  Top 0.305: STM32F4.72 62.92,54.03 | 62.92,54.03 68.32,54.03 71.12,56.83 71.12,58.74 72.07,59.69 51-75.22 | 62.92,54.03 v64.45,54.93 | v64.14,78.74 v64.14,81.28 | v60.01,88.58 58.42,90.17 v57.78,90.17
  Bottom 0.305: v64.45,54.93 63.82,55.88 61.59,58.1 61.59,68.58 62.23,69.22 66.36,69.22 70.17,73.03 70.17,76.2 71.12,76.52 71.12,78.42 70.8,78.74 v64.14,78.74 | v64.14,81.28 60.01,85.41 v60.01,88.58 | v57.78,90.17 56.83,89.22 48.26,89.22 46.99,90.49 46.99,92.71 ISPJTAG.7
PA14
  Top 0.305: STM32F4.76 55.53,57.5 55.56,57.47 55.56,64.45 62.23,71.12 63.18,71.12 64.77,72.71 64.77,74.93 76-100.1 63.18,78.11 62.55,79.38 50.8,79.38 48.9,81.28 48.9,87 46.35,89.53 45.09,89.53 44.45,90.17 44.45,92.71 ISPJTAG.9
PA15  (via drill 0.6)
  Top 0.305: STM32F4.77 55.03,64.87 62.23,72.07 62.87,72.07 63.5,72.71 76-100.2 | ISPJTAG.5 49.53,92.71 49.53,81.92 51.44,80.01 57.78,80.01 58.1,80.33 v60.01,80.33
  Bottom 0.305: v60.01,80.33 60.33,80.33 62.23,78.42 62.23,74.93 76-100.2
PB0  (via drill 0.6)
  Top 0.305: STM32F4.35 48.03,31.52 43.18,26.67 26-50.10 | CTRL_BUS.2 CTRL_BUS.1 7.94,50.8 13.02,45.72 13.02,37.15 v13.97,36.2 | v17.46,33.66 17.46,32.7 20,30.16 v29.53,30.16
  Bottom 0.305: v29.53,30.16 41.59,30.16 43.18,28.57 26-50.10 | v13.97,36.2 16.51,35.56 v17.46,33.66
PB1  (via drill 0.6)
  Top 0.305: STM32F4.36 48.53,30.11 47.31,28.89 46.35,28.89 44.45,26.99 44.45,24.13 26-50.11 | CTRL_BUS.4 CTRL_BUS.3 8.89,53.34 10.16,52.07 10.16,49.85 v14.29,45.72 | v16.83,43.81 16.83,37.15 17.14,36.2 18.41,34.61 18.41,33.02 20,31.43 v27.94,31.43
  Bottom 0.305: v14.29,45.72 14.61,45.72 v16.83,43.81 | v27.94,31.43 31.43,31.43 32.07,30.8 41.91,30.8 44.45,28.26 44.45,24.13 26-50.11
PB2  (via drill 0.6)
  Top 0.305: STM32F4.37 49.03,29.34 47.62,27.94 46.35,27.94 45.72,27.3 26-50.12 | CTRL_BUS.6 CTRL_BUS.5 8.26,55.88 v12.7,51.44 | v19.05,46.04 19.05,33.97 20.64,32.38 v29.84,32.38
  Bottom 0.305: v12.7,51.44 18.1,51.44 19.05,50.48 v19.05,46.04 | v29.84,32.38 32.07,32.38 32.7,31.75 42.23,31.75 45.72,28.26 26-50.12
PB3  (via drill 0.6)
  Top 0.305: STM32F4.89 49.03,72.89 76-100.14 48.26,74.61 46.99,75.88 46.99,84.77 | 46.99,84.77 46.99,87 v45.72,88.27 | CTRL_BUS.8 CTRL_BUS.7 11.75,58.42 13.97,60.64 v16.83,60.64 | v19.37,61.91 v19.37,76.52 | v21.27,78.74 26.99,84.45 46.67,84.45 46.99,84.77
  Bottom 0.305: v45.72,88.27 41.27,88.27 39.37,90.17 39.37,92.71 ISPJTAG.13 | v16.83,60.64 18.1,60.64 v19.37,61.91 | v19.37,76.52 19.37,76.83 v21.27,78.74
PB4  (via drill 0.6)
  Top 0.305: STM32F4.90 48.53,70.85 46.99,72.39 46.99,74.93 76-100.15 45.72,80.33 44.77,81.6 25.4,81.6 22.86,79.06 v22.86,77.79 | CTRL_BUS.10 CTRL_BUS.9 12.7,60.96 13.65,61.91 v14.61,61.91 | v18.1,63.5 v18.1,74.93
  Bottom 0.305: v14.61,61.91 16.51,61.91 v18.1,63.5 | v18.1,74.93 20,74.93 v22.86,77.79
PB5  (via drill 0.6)
  Top 0.305: STM32F4.91 48.03,70.4 45.72,72.71 76-100.16 | CTRL_BUS.12 CTRL_BUS.11 13.02,63.5 13.97,64.45 13.97,65.72 v14.92,66.67
  Bottom 0.305: v14.92,66.67 20.32,66.67 21.91,68.26 42.23,68.26 45.4,71.44 45.4,73.34 76-100.16
PB6
  Top 0.305: STM32F4.92 47.53,69.63 44.45,72.71 44.45,74.93 76-100.17
  Bottom 0.305: GPUHDR.7 68.58,93.03 67.31,91.76 61.28,91.76 56.52,87 43.5,87 43.5,76.52 76-100.17
PB7  (via drill 0.6)
  Top 0.305: STM32F4.93 47.03,69.17 43.18,73.03 76-100.18 | v53.34,85.72 56.52,85.72 58.42,87.63 63.18,87.63 64.45,93.66 65.72,93.66 GPUHDR.8
  Bottom 0.305: 76-100.18 43.18,73.98 44.45,75.25 44.45,86.36 51.75,86.36 v53.34,85.72
PB8  (via drill 0.6)
  Top 0.305: STM32F4.95 46.03,68.27 43.5,70.8 42.23,70.8 40.64,72.39 76-100.20 | CTRL_BUS.14 CTRL_BUS.13 11.75,66.04 v14.92,69.22
  Bottom 0.305: v14.92,69.22 39.05,69.22 40.64,70.8 76-100.20
PB9  (via drill 0.6)
  Top 0.305: STM32F4.96 45.53,67.5 43.5,69.53 42.23,69.53 39.37,72.39 39.37,74.93 76-100.21 | CTRL_BUS.16 CTRL_BUS.15 11.43,68.58 v14.92,71.75
  Bottom 0.305: v14.92,71.75 30.8,71.75 31.43,71.12 35.56,71.12 36.83,72.39 36.83,74.93 76-100.21
PB10  (via drill 0.6)
  Top 0.305: STM32F4.47 54.03,30.43 57.47,26.99 58.1,26.99 58.42,26.67 26-50.22 | v77.15,5.4 78.74,5.4 v81.28,2.86
  Bottom 0.305: 26-50.22 58.42,26.67 59.69,27.94 67.31,27.94 72.07,23.18 72.07,10.48 v77.15,5.4 | v81.28,2.86 82.55,1.59 92.39,1.59 93.34,2.54 93.34,63.82 94.93,65.41 94.93,77.15 89.53,82.55 89.53,92.39 91.12,93.98 VGAHDR.1
PB11  (via drill 0.6)
  Top 0.305: STM32F4.48 54.53,31.2 57.78,27.94 58.74,27.94 59.69,26.99 59.69,24.13 26-50.23 | v76.83,3.49 78.74,1.59 90.49,1.59 91.76,2.86 v91.76,3.17 | v91.12,77.47 91.44,77.79 v91.44,82.87
  Bottom 0.305: 26-50.23 61.59,22.23 61.59,20.64 62.23,20 70.17,20 71.12,19.05 71.12,8.89 76.52,3.49 v76.83,3.49 | v91.76,3.17 91.76,53.34 91.12,53.98 v91.12,77.47 | v91.44,82.87 91.44,90.17 92.08,90.81 VGAHDR.2
PB12
  Top 0.305: STM32F4.51 64.1,43.53 68.58,39.05 68.58,37.47 73.03,33.02 74.93,33.02 51-75.1 76.83,33.66 76.83,11.75 75.25,10.16 IOHDR.6
PB13
  Top 0.305: STM32F4.52 64.56,44.03 69.22,39.37 69.22,38.1 73.03,34.29 51-75.2
PB14
  Top 0.305: STM32F4.53 65.01,44.53 69.85,39.69 69.85,38.42 72.71,35.56 74.93,35.56 51-75.3
PB15
  Top 0.305: STM32F4.54 65.46,45.03 70.8,39.69 70.8,38.42 72.39,36.83 51-75.4
PC0  (via drill 0.6)
  Top 0.305: 1-25.15 22.86,48.26 25.08,48.26 25.4,48.58 25.45,48.53 STM32F4.15 43.04,48.53 43.28,48.77 43.28,49.07 48.16,53.95 v50.9,53.95
  Bottom 0.305: v50.9,53.95 67.36,53.95 69.19,55.78 69.19,59.59 70.71,61.11 70.71,65.84 75.13,70.26 76.34,71.21 76.64,71.83 76.64,78.23 R3.1
PC1  (via drill 0.6)
  Top 0.305: 1-25.16 24.77,47.62 25.4,47.62 25.8,48.03 STM32F4.16 43.27,48.03 46.04,51.12 46.35,51.12 47.94,52.7 v49.21,52.7
  Bottom 0.305: v49.21,52.7 67.31,52.7 69.85,55.24 69.85,59.05 71.75,60.96 71.75,65.72 75.25,69.22 76.83,69.22 78.74,71.12 R2.1
PC2  (via drill 0.6)
  Top 0.305: 1-25.17 22.86,45.72 24.77,45.72 26.57,47.53 STM32F4.17 43.57,47.53 46.04,50.16 47.31,50.16 v48.26,51.12
  Bottom 0.305: v48.26,51.12 69.53,51.12 71.75,53.34 R5.1
PC3  (via drill 0.6)
  Top 0.305: 1-25.18 24.45,44.77 24.77,44.77 27.03,47.03 STM32F4.18 43.85,47.03 46.35,49.53 48.58,49.53 v49.53,50.16 | v83.5,46.04 83.82,46.04 85.41,47.62 85.41,49.21 R4.1
  Bottom 0.305: v49.53,50.16 68.26,50.16 72.71,45.72 83.19,45.72 v83.5,46.04
PC4  (via drill 0.6)
  Top 0.305: STM32F4.33 47.03,32.42 41.91,27.3 41.27,27.3 40.64,26.67 26-50.8 | R7.1 85.09,24.77 86.68,23.5 86.68,15.56 85.41,14.61 82.87,14.61 79.69,11.43 v78.11,11.43 | v73.98,11.43 49.85,11.43 49.21,11.11 v42.55,11.11
  Bottom 0.305: v78.11,11.43 v73.98,11.43 | v42.55,11.11 41.91,12.06 41.91,24.45 26-50.8
PC5  (via drill 0.6)
  Top 0.305: STM32F4.34 47.53,31.97 41.91,26.35 41.91,24.13 26-50.9 | R6.1 84.45,21.59 83.5,20.64 83.5,16.19 80.64,13.34 v79.06,13.02 | v73.98,13.02 v53.02,13.02 | v53.02,16.51 v50.8,16.51
  Bottom 0.305: v79.06,13.02 v73.98,13.02 | v53.02,13.02 v53.02,16.51 | v50.8,16.51 44.77,16.51 42.86,18.41 42.86,22.54 26-50.9
PC6
  Top 0.305: STM32F4.63 71.44,49.53 72.71,48.26 74.93,48.26 51-75.13 76.52,49.21 80.64,49.21 81.28,49.85 81.28,69.53 82.55,70.8 D7.A
  Bottom 0.305: D1.A 84.77,16.51 83.19,18.1 83.19,42.55 D9.A 85.09,46.04 83.19,47.94 77.79,47.94 51-75.13
PC7  (via drill 0.6)
  Top 0.305: STM32F4.64 73.16,50.03 51-75.14 | D2.A 85.41,12.7 87.63,14.92 87.63,38.1 D10.A 82.55,43.18 v82.55,50.8 D8.A
  Bottom 0.305: v82.55,50.8 74.93,50.8 51-75.14
PC8
  Top 0.305: STM32F4.65 71.8,50.53 72.07,50.8 74.93,50.8 51-75.15
PC9
  Top 0.305: STM32F4.66 71.03,51.03 72.07,52.07 51-75.16
PC10
  Top 0.305: STM32F4.78 54.53,66.28 55.24,66.99 56.2,66.99 62.23,73.03 62.23,74.93 76-100.3
PC11
  Top 0.305: STM32F4.79 54.03,67.05 54.61,67.63 55.56,67.63 60.64,72.71 60.64,73.34 76-100.4
PC12
  Top 0.305: STM32F4.80 53.53,67.82 53.98,68.26 55.24,68.26 59.69,72.71 59.69,74.93 76-100.5
PC13
  Top 0.305: STM32F4.7 37.08,52.53 35.05,54.56 27.58,54.56 25.91,56.24 25.91,57.15 24.69,58.37 22.81,58.37 1-25.7
PC14
  Top 0.305: STM32F4.8 36.82,52.03 34.9,53.95 27.33,53.95 1-25.8
PC15
  Top 0.305: STM32F4.9 36.56,51.53 34.75,53.34 22.86,53.34 1-25.9
PD0  (via drill 0.6)
  Top 0.305: STM32F4.81 53.03,68.59 53.66,69.22 55.24,69.22 58.42,72.39 76-100.6 | DATA_BUS.1 83.82,86.04 82.23,84.45 80.64,84.45 76.52,80.33 72.39,80.33 v69.53,77.47
  Bottom 0.305: v69.53,77.47 67.63,77.47 67.31,77.15 67.31,76.52 66.36,75.56 66.36,72.71 65.09,71.44 59.05,71.44 58.26,72.23 58.26,73.5 76-100.6
PD1  (via drill 0.6)
  Top 0.305: STM32F4.82 52.53,69.04 53.34,69.85 54.61,69.85 57.15,72.39 57.15,74.93 76-100.7 | DATA_BUS.2 81.28,87 76.2,81.6 v72.07,81.6
  Bottom 0.305: v72.07,81.6 70.48,80.01 62.55,80.01 61.28,81.28 61.28,81.6 59.05,81.6 58.42,80.96 58.42,80.01 57.15,78.74 56.52,78.74 55.88,78.11 76-100.7
PD2  (via drill 0.6)
  Top 0.305: STM32F4.83 52.03,69.81 52.7,70.48 54.29,70.48 55.88,72.07 76-100.8 | v68.26,73.03 68.26,80.64 70.48,82.87 75.25,82.87 76.83,84.45 77.15,84.45 78.74,86.04 DATA_BUS.3
  Bottom 0.305: 76-100.8 55.88,72.07 57.78,70.17 65.41,70.17 v68.26,73.03
PD3  (via drill 0.6)
  Top 0.305: STM32F4.84 51.53,70.58 52.07,71.12 53.34,71.12 54.61,72.39 54.61,74.93 76-100.9 | DATA_BUS.4 76.2,86.04 73.98,83.82 70.17,83.82 68.9,82.55 58.74,82.55 57.15,80.96 v56.52,80.96
  Bottom 0.305: v56.52,80.96 56.2,80.96 53.34,78.11 76-100.9
PD4  (via drill 0.6)
  Top 0.305: STM32F4.85 51.03,71.03 52.07,72.07 53.02,72.07 53.34,72.39 76-100.10 | DATA_BUS.5 73.66,86.04 72.39,84.77 70.17,84.77 68.58,83.19 58.42,83.19 57.15,81.92 v54.93,81.92
  Bottom 0.305: v54.93,81.92 54.93,81.6 52.07,78.74 52.07,74.93 76-100.10
PD5  (via drill 0.6)
  Top 0.305: STM32F4.86 50.53,71.48 52.07,73.03 52.07,74.93 76-100.11 | DATA_BUS.6 71.12,86.68 68.26,83.82 58.1,83.82 57.15,82.87 53.98,82.87 v53.34,82.23
  Bottom 0.305: v53.34,82.23 50.8,79.69 76-100.11
PD6  (via drill 0.6)
  Top 0.305: STM32F4.87 50.03,72.89 76-100.12 | DATA_BUS.7 68.58,86.04 67.31,84.77 57.78,84.77 56.83,83.82 v52.39,83.82
  Bottom 0.305: v52.39,83.82 52.07,83.82 49.53,81.28 49.53,74.93 76-100.12
PD7  (via drill 0.6)
  Top 0.305: STM32F4.88 49.53,74.93 76-100.13 | DATA_BUS.8 63.82,86.68 58.42,86.68 56.52,84.77 v50.8,84.77
  Bottom 0.305: v50.8,84.77 49.85,84.77 47.94,82.87 47.94,76.52 76-100.13
PD8  (via drill 0.6)
  Top 0.305: STM32F4.55 65.91,45.53 71.44,40.01 71.44,39.05 72.39,38.1 74.93,38.1 51-75.5 80.96,34.61 80.96,19.05 80.33,18.41 v79.06,18.41 | ADDRESS_BUS.17 6.35,25.4 8.89,25.4 12.06,22.23 12.06,19.05 12.7,18.41 v34.61,18.41 | v36.83,18.41 v59.37,18.41 | v67.94,18.41 v73.98,18.41
  Bottom 0.305: v34.61,18.41 v36.83,18.41 | v59.37,18.41 v67.94,18.41 | v73.98,18.41 v79.06,18.41
PD9  (via drill 0.6)
  Top 0.305: STM32F4.56 66.36,46.03 73.03,39.37 51-75.6 | ADDRESS_BUS.18 8.89,24.13 11.11,21.91 11.11,18.1 11.75,17.46 v32.38,17.46 | v39.05,17.46 v61.59,17.46 | v65.09,17.46 v75.88,17.46 | v77.79,17.46 80.64,17.46 81.6,18.41 81.6,35.24 v79.06,38.1
  Bottom 0.305: v32.38,17.46 v39.05,17.46 | v61.59,17.46 v65.09,17.46 | v75.88,17.46 v77.79,17.46 | v79.06,38.1 74.93,38.1 51-75.6
PD10  (via drill 0.6)
  Top 0.305: STM32F4.57 68.09,46.53 68.58,46.04 68.58,45.09 73.03,40.64 74.93,40.64 51-75.7 76.52,41.91 79.38,39.05 82.23,38.42 82.23,17.46 80.96,16.19 v79.06,16.19 | ADDRESS_BUS.19 6.35,22.86 8.89,22.86 10.16,21.59 10.16,16.51 11.43,15.24 30.16,15.24 31.11,16.19 v34.29,16.19 | v37.15,16.19 40.32,16.19 40.96,15.56 57.15,15.56 58.1,16.19 v59.37,16.19 | v67.94,16.19 v73.98,16.19
  Bottom 0.305: v34.29,16.19 v37.15,16.19 | v59.37,16.19 v67.94,16.19 | v73.98,16.19 v79.06,16.19
PD11  (via drill 0.6)
  Top 0.305: STM32F4.58 68.86,47.03 69.53,46.35 69.53,45.09 72.71,41.91 51-75.8 | ADDRESS_BUS.20 8.26,21.59 9.53,20.32 9.53,15.88 10.79,14.61 33.02,14.61 v32.38,14.92 | v39.05,14.92 40.01,14.92 40.32,14.61 60.64,14.61 60.96,14.92 v61.59,14.92 | v64.77,14.61 v75.88,14.61 | v77.79,14.61 80.96,14.61 82.87,16.51 82.87,39.05 80.64,39.69 79.69,39.69 78.42,40.96 v78.42,41.91
  Bottom 0.305: v32.38,14.92 v39.05,14.92 | v61.59,14.92 v64.77,14.61 | v75.88,14.61 v77.79,14.61 | v78.42,41.91 78.42,41.59 77.79,40.96 74.93,40.64 51-75.8
PD12  (via drill 0.6)
  Top 0.305: STM32F4.59 69.31,47.53 70.17,46.67 70.17,45.4 72.39,43.18 74.93,43.18 51-75.9 79.38,44.45 80.01,43.81 v80.01,41.27 | v13.97,12.38 19.68,12.38 20.64,13.34 46.04,13.34 v47.31,12.06
  Bottom 0.305: ADDRESS_BUS.21 5.08,14.61 6.03,13.65 12.7,13.65 v13.97,12.38 | v47.31,12.06 47.31,9.84 49.53,7.62 49.53,4.13 51.44,2.22 77.15,2.22 80.96,6.03 80.96,40.32 v80.01,41.27
PD13  (via drill 0.6)
  Top 0.305: STM32F4.60 69.76,48.03 70.8,46.99 70.8,46.04 72.39,44.45 51-75.10 | ADDRESS_BUS.22 7.62,13.97 v9.53,12.06 | v13.02,10.79 19.05,10.79 20.95,12.7 44.45,12.7 v45.4,12.06
  Bottom 0.305: v9.53,12.06 11.75,12.06 v13.02,10.79 | v45.4,12.06 45.4,10.48 48.9,6.99 48.9,3.17 49.85,2.22 50.16,2.22 50.8,1.59 77.47,1.59 81.6,5.71 81.6,41.59 80.01,43.18 74.93,43.18 51-75.10
PD14
  Top 0.305: STM32F4.61 70.53,48.53 71.44,47.62 71.44,46.99 72.71,45.72 74.93,45.72 51-75.11
PD15
  Top 0.305: STM32F4.62 70.98,49.03 72.07,47.94 72.07,47.31 72.39,46.99 51-75.12
PE0  (via drill 0.6)
  Top 0.305: STM32F4.97 45.03,67.05 43.5,68.58 41.91,68.58 38.1,72.39 76-100.22 | ADDRESS_BUS.1 5.08,46.35 1.27,49.53 1.27,80.33 7.62,86.04 v12.7,86.04 | v26.99,82.87 v35.56,82.87
  Bottom 0.305: v12.7,86.04 23.81,86.04 v26.99,82.87 | v35.56,82.87 36.2,82.87 39.37,79.69 39.37,74.93 76-100.22
PE1  (via drill 0.6)
  Top 0.305: STM32F4.98 44.53,66.28 43.18,67.63 41.59,67.63 36.83,72.39 36.83,74.93 76-100.23 35.56,78.74 34.61,79.69 v28.26,79.69 | 7.3,45.4 6.35,46.35 4.45,47.94 1.91,49.85 1.91,80.01 7.94,85.09 v14.92,85.09
  Top 0.406: ADDRESS_BUS.2 7.3,45.4
  Bottom 0.305: v14.92,85.09 22.86,85.09 v28.26,79.69
PE2
  Top 0.305: STM32F4.1 39.72,55.53 36.83,58.42 30.16,58.42 29.84,58.74 29.84,62.23 26.04,66.04 22.86,66.04 1-25.1
  Bottom 0.305: ADDRESS_BUS.3 6.35,43.18 9.84,43.18 10.48,43.81 10.48,60.33 15.24,65.09 21.27,65.09 1-25.1
PE3  (via drill 0.6)
  Top 0.305: STM32F4.2 39.27,55.03 36.51,57.78 29.84,57.78 29.21,58.42 29.21,61.59 26.04,64.77 1-25.2 | v30.8,59.37 30.8,62.55 28.89,64.45 v28.89,65.09
  Bottom 0.305: ADDRESS_BUS.4 13.34,41.91 13.65,41.59 18.1,41.59 19.68,43.18 19.68,45.09 20.32,45.72 29.21,45.72 29.53,46.04 29.53,58.1 v30.8,59.37 | v28.89,65.09 24.45,65.09 1-25.2
PE4  (via drill 0.6)
  Top 0.305: STM32F4.3 38.81,54.53 36.2,57.15 29.21,57.15 28.57,57.78 28.57,60.96 26.04,63.5 22.86,63.5 1-25.3 | v33.66,60.01 33.66,61.91 32.07,63.5 v31.75,63.5
  Bottom 0.305: ADDRESS_BUS.5 6.35,40.64 18.1,40.64 20.64,43.18 35.56,43.18 36.83,44.45 36.83,58.42 35.56,59.69 33.97,59.69 v33.66,60.01 | v31.75,63.5 22.86,63.5 1-25.3
PE5  (via drill 0.6)
  Top 0.305: STM32F4.4 38.36,54.03 35.88,56.52 28.57,56.52 27.94,57.15 27.94,60.33 26.04,62.23 1-25.4 | v37.15,42.23 v39.37,42.23
  Bottom 0.305: ADDRESS_BUS.6 9.84,39.37 10.48,40.01 11.75,40.01 12.38,39.37 19.68,39.37 20.95,40.64 36.63,40.64 v37.15,42.23 | v39.37,42.23 39.37,59.37 36.51,62.23 1-25.4
PE6
  Top 0.305: STM32F4.5 37.91,53.53 35.56,55.88 28.26,55.88 27.3,56.83 27.3,58.74 25.08,60.96 22.86,60.96 1-25.5
  Bottom 0.305: ADDRESS_BUS.7 5.08,37.15 6.03,38.1 34.92,38.1 38.1,41.27 38.1,59.37 36.51,60.96 22.86,60.96 1-25.5
PE7  (via drill 0.6)
  Top 0.305: 26-50.13 46.99,24.13 46.99,26.35 49.53,28.89 49.53,40.96 STM32F4.38 49.53,44.13 v48.58,45.09
  Bottom 0.305: ADDRESS_BUS.8 11.43,36.83 11.75,37.15 18.41,37.15 20,35.56 25.72,35.56 27.62,37.47 35.56,37.47 39.05,40.96 40.32,40.96 41.27,45.09 v48.58,45.09
PE8  (via drill 0.6)
  Top 0.305: 26-50.14 48.26,26.67 50.03,28.44 STM32F4.39 50.03,45.54 v49.21,46.35 | ADDRESS_BUS.9 6.35,33.02 8.89,33.02 10.48,31.43 10.48,30.48 17.78,23.18 23.5,23.18 25.4,25.08 v25.4,26.99 | v45.09,43.18 v46.01,46.35
  Bottom 0.305: v25.4,26.99 25.4,31.75 27.94,34.29 32.7,34.29 34.29,35.88 38.42,35.88 v45.09,43.18 | v46.01,46.35 v49.21,46.35
PE9  (via drill 0.6)
  Top 0.305: 26-50.15 49.53,24.13 49.53,26.99 50.53,27.99 STM32F4.40 50.53,46.31 50.16,46.67 50.16,46.99 49.53,47.62 v47.94,47.62 | ADDRESS_BUS.10 8.57,34.29 11.11,31.75 11.11,30.8 18.1,23.81 22.86,23.81 24.45,25.4 v24.45,28.26 | v37.78,36.83 42.86,41.91 42.86,44.54 43.98,44.54 44.01,46.55 45.72,47.31 v46.04,47.62
  Bottom 0.305: v24.45,28.26 24.45,31.75 27.62,34.92 32.38,34.92 33.97,36.51 v37.78,36.83 | v46.04,47.62 v47.94,47.62
PE10  (via drill 0.6)
  Top 0.305: 26-50.16 50.8,26.99 51.03,27.22 STM32F4.41 51.03,45 51.12,45.4 v51.12,47.31 | ADDRESS_BUS.11 6.35,30.48 8.57,30.48 17.14,21.91 25.08,21.91 v28.89,25.72 | v32.7,28.57 32.7,31.75 v33.66,32.7
  Bottom 0.305: v28.89,25.72 30.8,27.62 31.75,27.62 v32.7,28.57 | v33.66,32.7 33.66,33.34 34.92,34.61 49.85,34.61 50.16,34.92 50.16,45.72 v51.12,47.31
PE11  (via drill 0.6)
  Top 0.305: 26-50.17 52.07,24.13 52.07,26.99 51.53,27.53 STM32F4.42 51.53,44.86 52.39,45.72 53.02,47.62 51.75,48.58 47.31,48.58 46.99,48.26 v46.99,43.5 | ADDRESS_BUS.12 8.26,31.75 17.46,22.54 24.13,22.54 26.67,25.08 v26.67,28.26
  Bottom 0.305: v26.67,28.26 26.67,32.07 27.94,33.34 28.57,33.34 28.89,33.66 33.02,33.66 34.61,35.24 38.73,35.24 v46.99,43.5
PE12
  Top 0.305: STM32F4.43 52.03,27.98 53.34,26.67 26-50.18
  Bottom 0.305: ADDRESS_BUS.13 6.35,27.94 8.89,27.94 19.68,17.14 19.68,10.16 20.95,8.89 21.59,8.89 23.18,7.3 23.18,6.35 24.13,5.4 39.05,5.4 43.81,10.16 43.81,12.06 45.4,13.65 49.53,13.65 52.07,16.19 52.07,24.13 26-50.18
PE13  (via drill 0.6)
  Top 0.305: STM32F4.44 52.53,28.43 54.61,26.35 54.61,24.13 26-50.19 54.29,21.27 v40.32,21.27 | ADDRESS_BUS.14 8.57,29.21 16.51,21.27 v31.11,21.27
  Bottom 0.305: v31.11,21.27 v40.32,21.27
PE14  (via drill 0.6)
  Top 0.305: STM32F4.45 53.03,28.89 54.93,26.99 55.56,26.99 55.88,26.67 26-50.20 | ADDRESS_BUS.15 6.35,27.94 8.57,27.94 14.29,22.23 14.29,21.27 15.24,20.32 v34.61,20.32 | v36.83,20.32 v53.34,20.32
  Bottom 0.305: v34.61,20.32 v36.83,20.32 | v53.34,20.32 54.61,21.59 54.61,24.13 26-50.20
PE15  (via drill 0.6)
  Top 0.305: STM32F4.46 53.53,29.97 57.15,26.35 57.15,24.13 26-50.21 55.88,20.32 55.56,20.32 54.61,19.37 v39.05,19.37 | ADDRESS_BUS.16 8.57,26.67 13.02,22.23 13.02,19.68 13.34,19.37 v32.38,19.37
  Bottom 0.305: v32.38,19.37 v39.05,19.37
PH0
  Top 0.305: STM32F4.12 30.74,50.03 29.45,51.32 26.04,51.44 25.2,52.27 24.33,52.27 1-25.12 | C2.1 15.24,50.48 GPUOSC.2
  Bottom 0.305: C2.1 16.51,55.88 19.05,53.34 22.86,53.34 1-25.12
PH1
  Top 0.305: STM32F4.13 30.48,49.53 29.21,50.8 22.86,50.8 1-25.13 16.83,46.67 15.56,44.77 GPUOSC.1 14.61,41.91 15.24,41.27 C5.1
VBAT
  Top 0.305: STM32F4.6 37.46,53.03 35.24,55.24 27.94,55.24 26.67,56.52 26.67,58.42 25.4,59.69 1-25.6 23.18,59.69 21.91,58.42 20.64,58.42 16.51,62.55 VBATPWRJP.1
VCAP_1
  Top 0.305: STM32F4.49 55.03,34.51 56.52,33.02 C9.1 58.42,29.21 60.96,26.67 26-50.24
VCAP_2
  Top 0.305: STM32F4.73 62.15,54.53 66.04,58.42 C8.1 74.93,60.96 51-75.23

### Text on the board
tPlace: RESET | SDA SCL NC RTS CTS RX TX CK | 1 | 1 | vsync / hsync / GND / R / G / B | 77 76 | 1 2 | 1 | 1 | 52 51 | 26 27 | Zikzak / www.zikzak.ca / Jeff Mitchell / GPU rev 2 06-2014 | TX / RX / 3*NC / VBL | GND / 3.3 / 5 / VCC | Pwr